# Altium project CanSat ADCS.PrjPcb
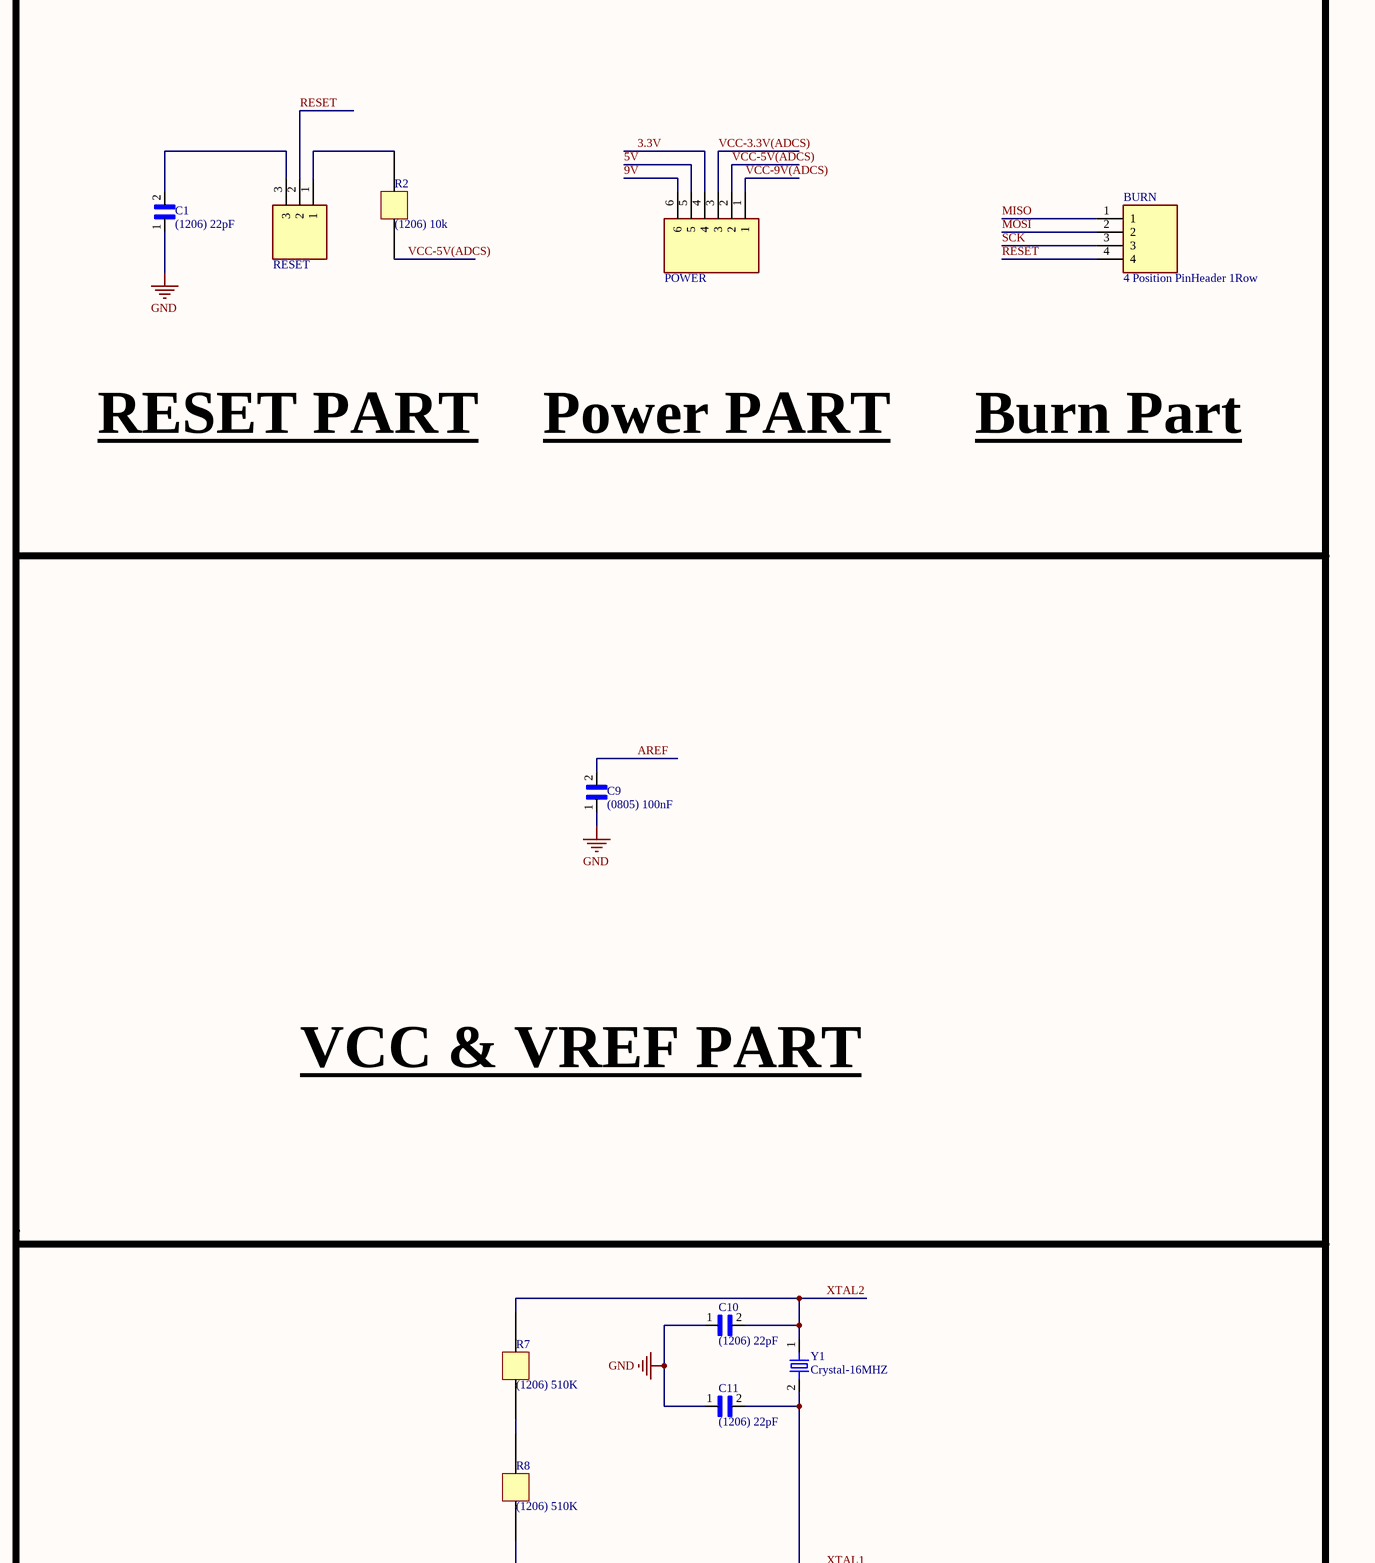
[diagram p0: CanSat ADCS.SchDoc, top left]
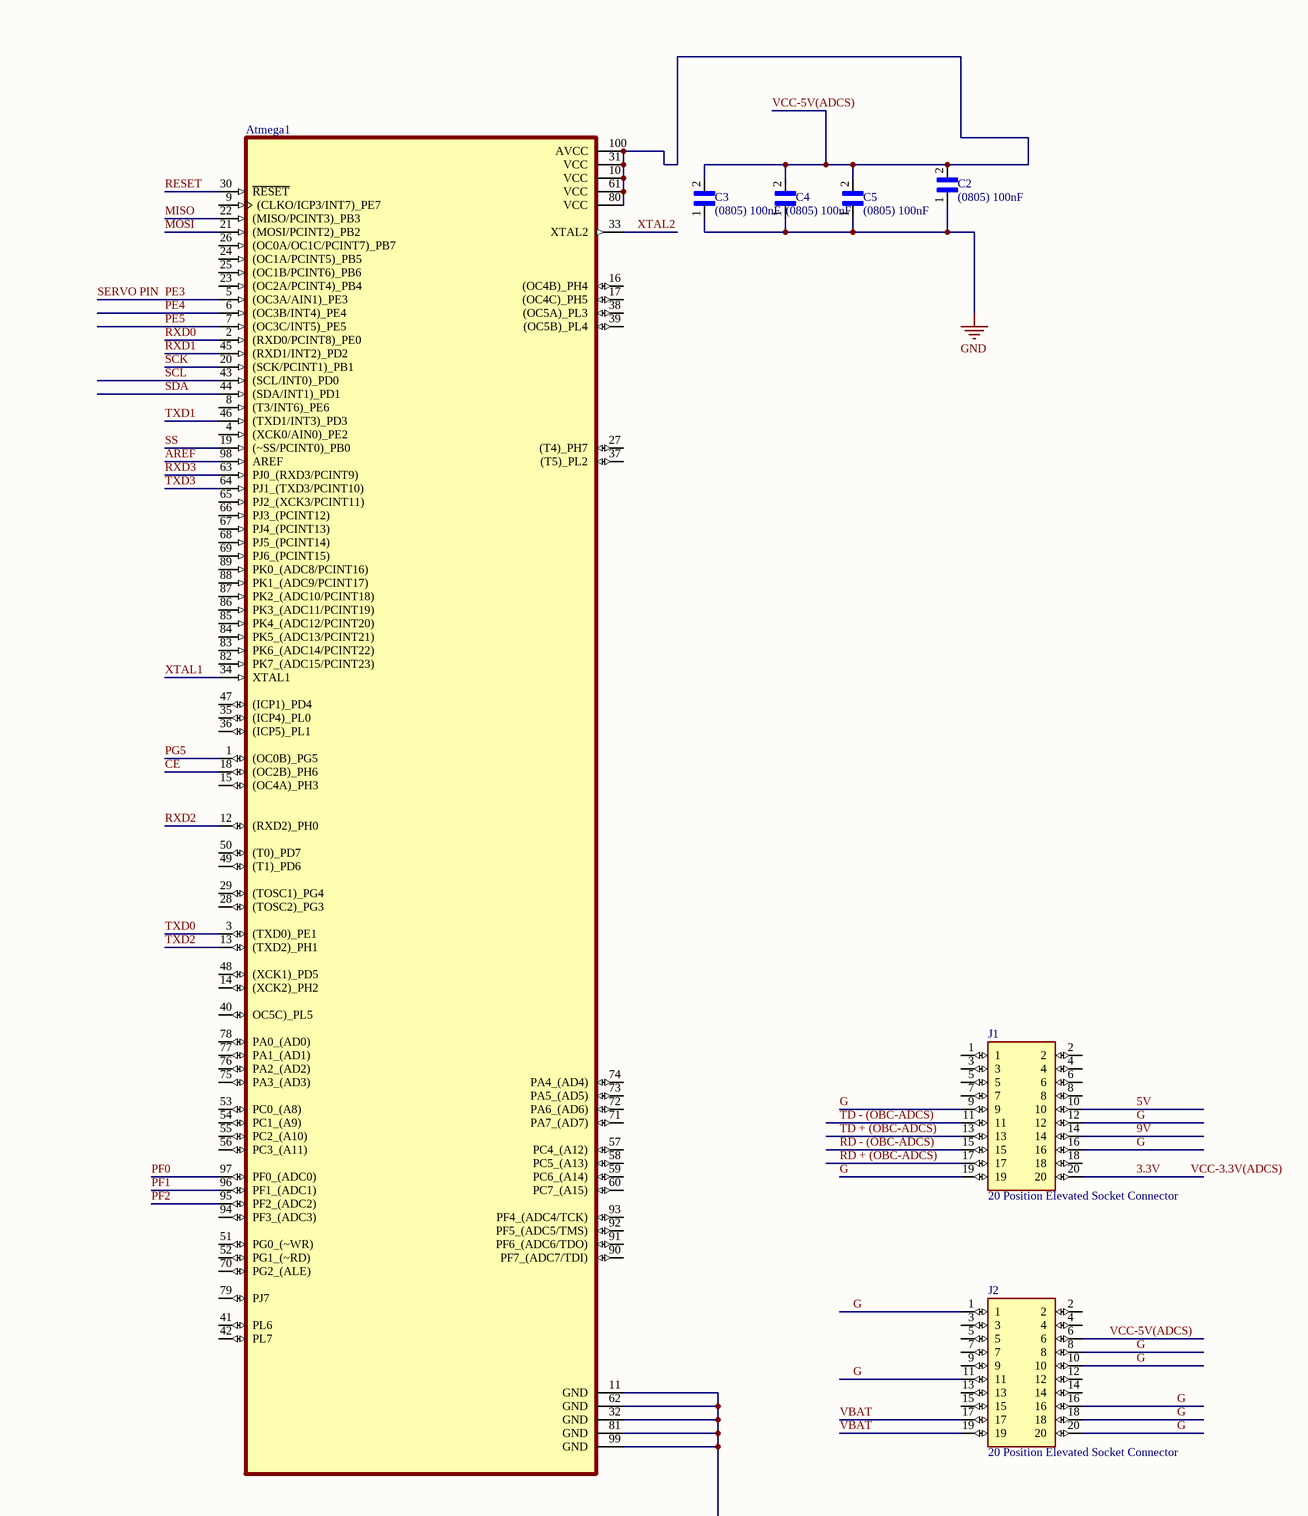
[diagram p1: CanSat ADCS.SchDoc, top middle]
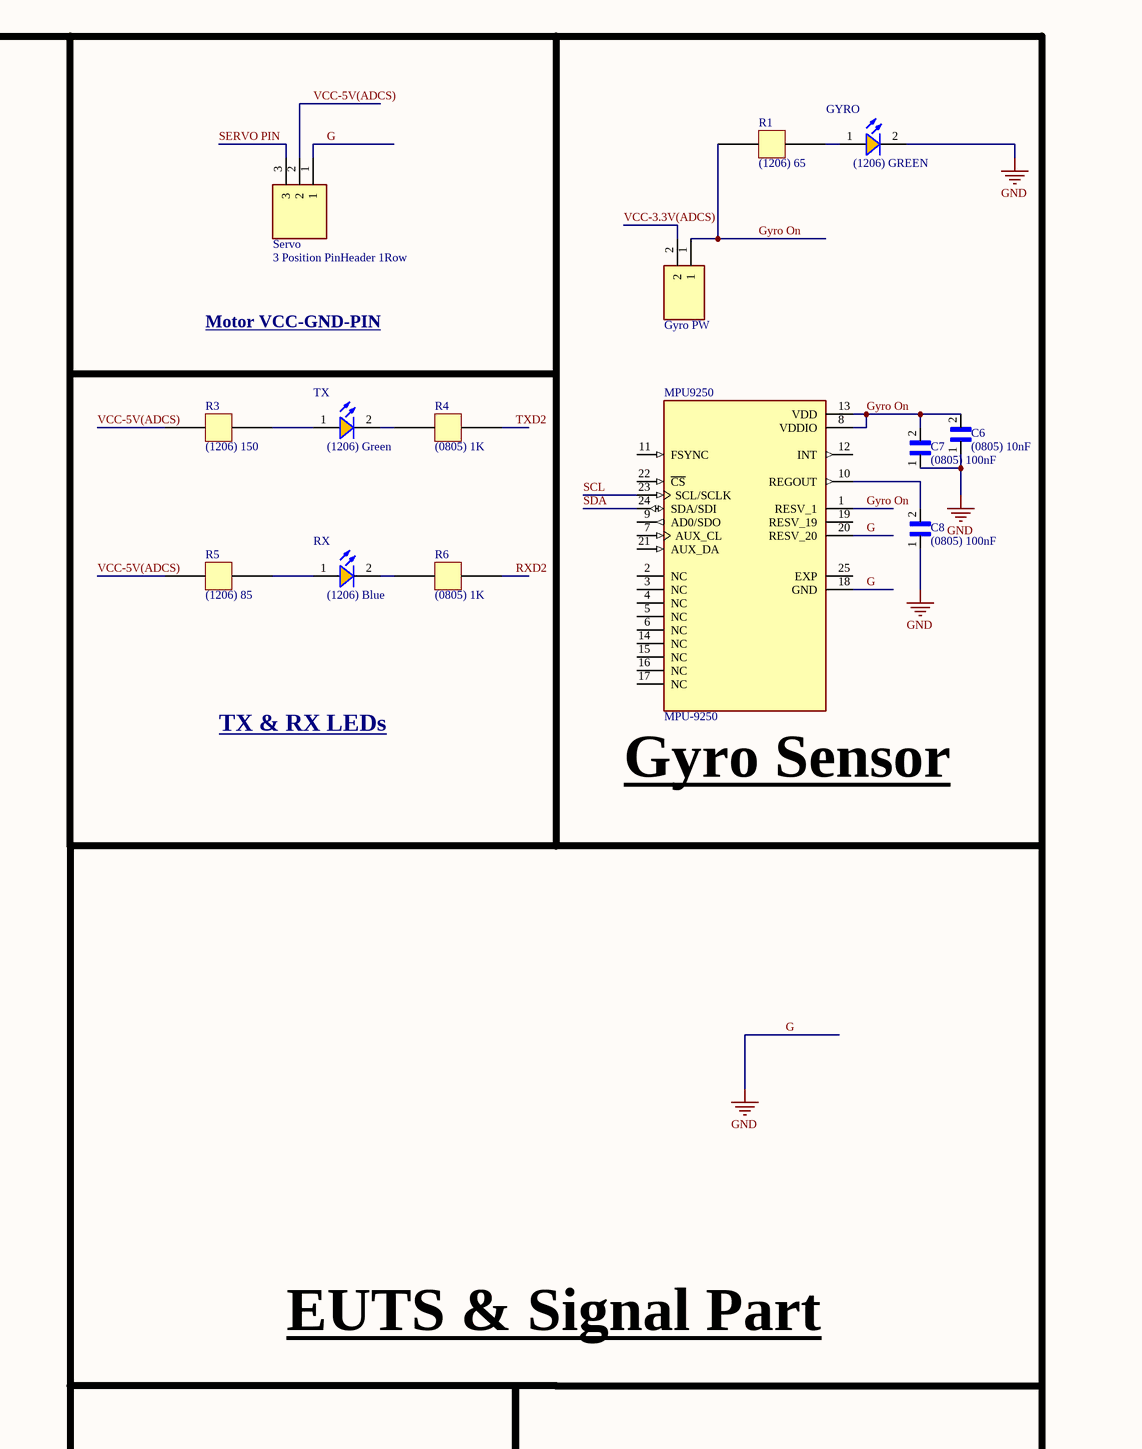
[diagram p2: CanSat ADCS.SchDoc, top right]
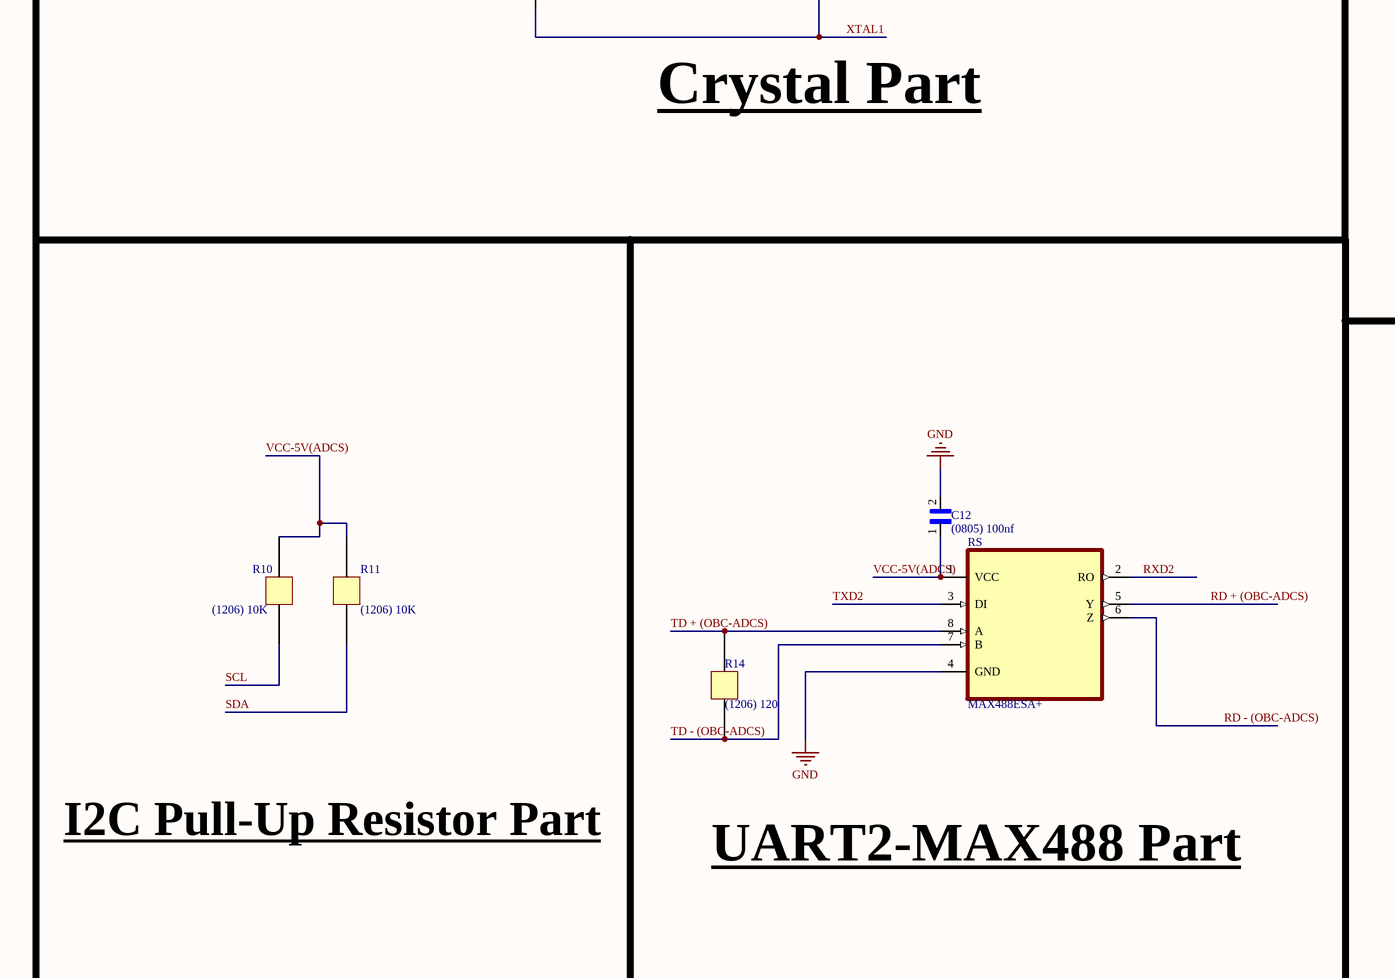
[diagram p3: CanSat ADCS.SchDoc, bottom left]
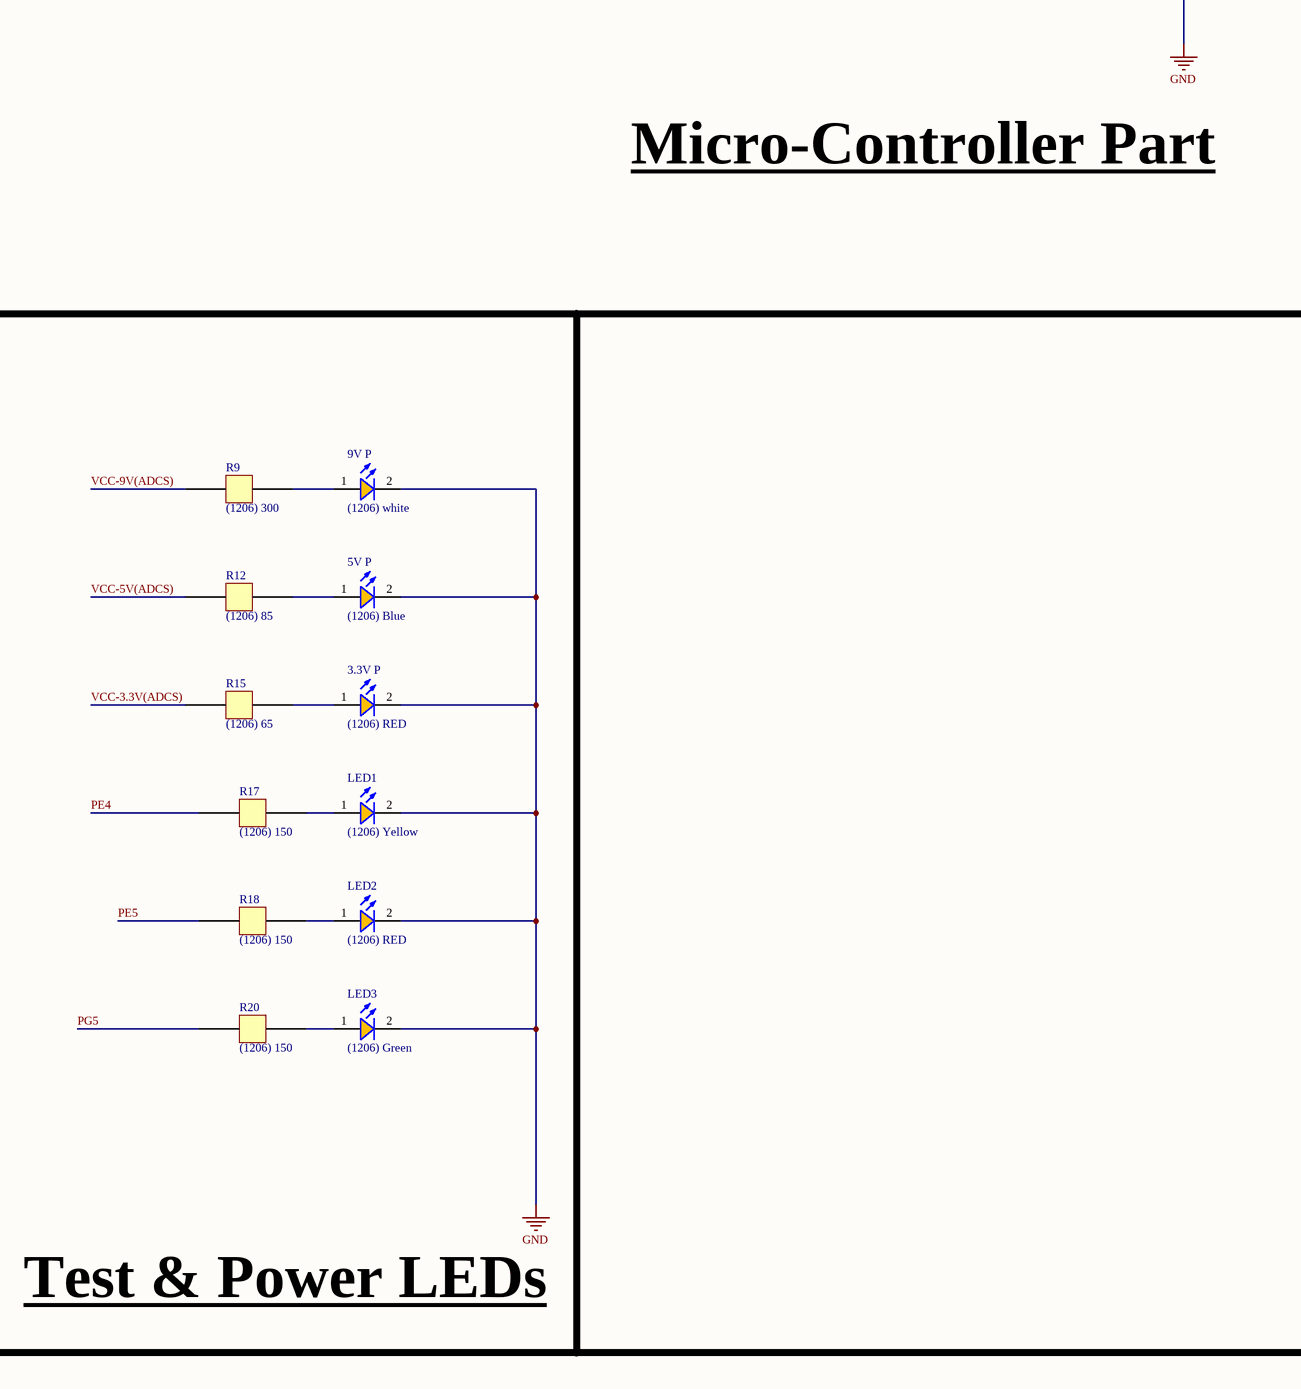
[diagram p4: CanSat ADCS.SchDoc, bottom middle]
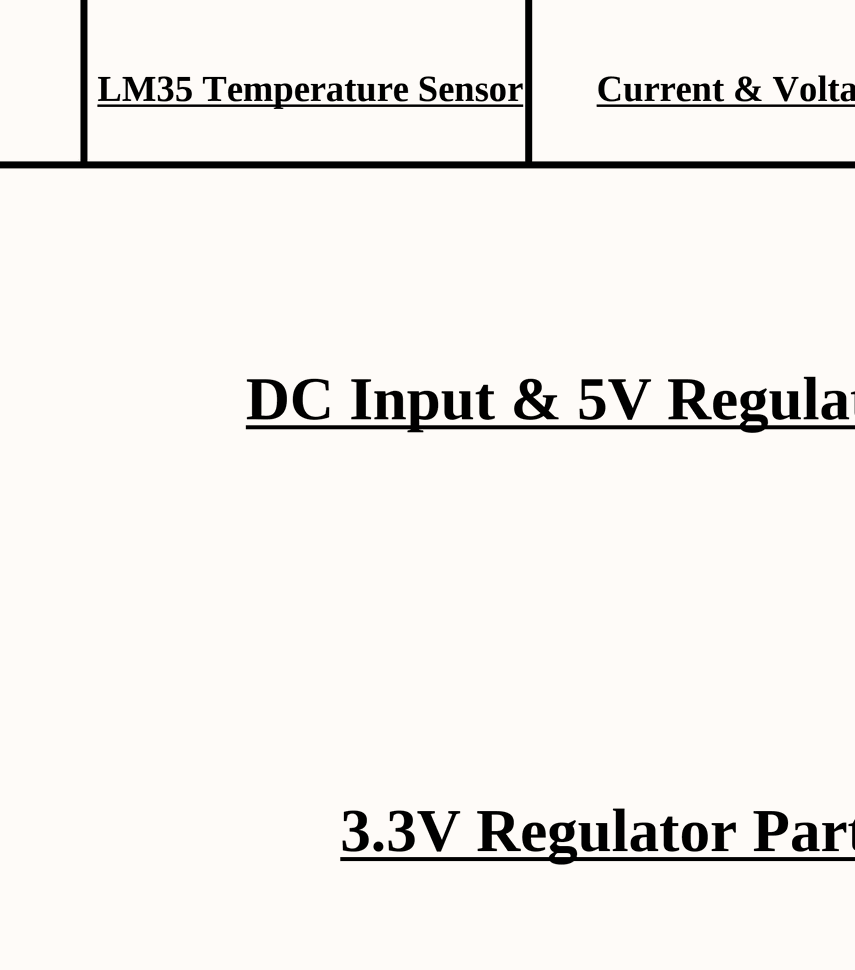
[diagram p5: CanSat ADCS.SchDoc, bottom right]
1 sheet, 49 parts. Net scope: global (net labels, ports and power ports of the same name join across sheets).
Board file: CanSat ADCS.PcbDoc

## Sheet CanSat ADCS.SchDoc
size A1; SheetNumber: 1; SheetTotal: 1

### Parts
3.3V_P  (1206) RED  [RESC3015X65-01]
5V_P  (1206) Blue  [RESC3015X65-01]
9V_P  (1206) white  [RESC3015X65-01]
Atmega1  (no value)  [QFP50P1600X1600X120-100N]
BURN  4 Position PinHeader 1Row  [TE_3-644456-4]
C1  (1206) 22pF  [CAPC3216X125N0]
C2  (0805) 100nF  [CAPC2012X95N-0]
C3  (0805) 100nF  [CAPC2012X95N-0]
C4  (0805) 100nF  [CAPC2012X95N-0]
C5  (0805) 100nF  [CAPC2012X95N-0]
C6  (0805) 10nF  [CAPC2012X95N-0]
C7  (0805) 100nF  [CAPC2012X95N-0]
C8  (0805) 100nF  [CAPC2012X95N-0]
C9  (0805) 100nF  [CAPC2012X95N-0]
C10  (1206) 22pF  [CAPC3216X125N0]
C11  (1206) 22pF  [CAPC3216X125N0]
C12  (0805) 100nf  [CAPC2012X95N-0]
GYRO  (1206) GREEN  [RESC3015X65-01]
Gyro_PW  2 Position PinHeader  [TE_2-103327-2]  (value not drawn)
J1  20 Position Elevated Socket Connector  [ESQ-110-XX-X-D]
J2  20 Position Elevated Socket Connector  [ESQ-110-XX-X-D]
LED1  (1206) Yellow  [RESC3015X65-01]
LED2  (1206) RED  [RESC3015X65-01]
LED3  (1206) Green  [RESC3015X65-01]
MPU9250  MPU-9250  [QFN40P300X300X105-25N]
POWER  6 Position PinHeader 1Row  [TE_6-146285-6]  (value not drawn)
R1  (1206) 65  [CAPC3216X125N0]
R2  (1206) 10k  [CAPC3216X125N0]
R3  (1206) 150  [CAPC3216X125N0]
R4  (0805) 1K  [CAPC2012X95N-0]
R5  (1206) 85  [CAPC3216X125N0]
R6  (0805) 1K  [CAPC2012X95N-0]
R7  (1206) 510K  [CAPC3216X125N0]
R8  (1206) 510K  [CAPC3216X125N0]
R9  (1206) 300  [CAPC3216X125N0]
R10  (1206) 10K  [CAPC3216X125N0]
R11  (1206) 10K  [CAPC3216X125N0]
R12  (1206) 85  [CAPC3216X125N0]
R14  (1206) 120  [CAPC3216X125N0]
R15  (1206) 65  [CAPC3216X125N0]
R17  (1206) 150  [CAPC3216X125N0]
R18  (1206) 150  [CAPC3216X125N0]
R20  (1206) 150  [CAPC3216X125N0]
RESET  3 Position PinHeader 1Row  [TE_3-103327-3]  (value not drawn)
RS  MAX488ESA+  [SOIC127P600X175-8N0]
RX  (1206) Blue  [RESC3015X65-01]
Servo  3 Position PinHeader 1Row  [TE_3-103327-3]
TX  (1206) Green  [RESC3015X65-01]
Y1  Crystal-16MHZ  [XTAL1140X490X430N-0]

### Nets
G: 3.3V_P.2(K) 5V_P.2(K) 9V_P.2(K) Atmega1.11(GND) Atmega1.32(GND) Atmega1.62(GND) Atmega1.81(GND) Atmega1.99(GND) C1.1 C2.1 C3.1 C4.1 C5.1 C6.1 C7.1 C8.1 C9.1 C10.1 C11.1 C12.2 GYRO.2(K) J1.9 J1.12 J1.16 J1.19 J2.1 J2.8 J2.10 J2.11 J2.16 J2.18 J2.20 LED1.2(K) LED2.2(K) LED3.2(K) MPU9250.18(GND) MPU9250.20(RESV_20) RS.4(GND) Servo.1  [also labelled GND]
3.3V: Gyro_PW.2 J1.20 POWER.3 POWER.4 R15.1  [also labelled VCC-3.3V(ADCS)]
5V: J1.10 POWER.5
9V: J1.14 POWER.6
AREF: Atmega1.98(AREF) C9.2
CE: Atmega1.18((OC2B)_PH6)
Gyro On: C6.2 C7.2 Gyro_PW.1 MPU9250.1(RESV_1) MPU9250.8(VDDIO) MPU9250.13(VDD) R1.1
MISO: Atmega1.22((MISO/PCINT3)_PB3) BURN.1
MOSI: Atmega1.21((MOSI/PCINT2)_PB2) BURN.2
PE3: Atmega1.5((OC3A/AIN1)_PE3) Servo.3  [also labelled SERVO PIN]
PE4: Atmega1.6((OC3B/INT4)_PE4) R17.1
PE5: Atmega1.7((OC3C/INT5)_PE5) R18.1
PF0: Atmega1.97(PF0_(ADC0))
PF1: Atmega1.96(PF1_(ADC1))
PF2: Atmega1.95(PF2_(ADC2))
PG5: Atmega1.1((OC0B)_PG5) R20.1
RD + (OBC-ADCS): J1.17 RS.5(Y)
RD - (OBC-ADCS): J1.15 RS.6(Z)
RESET: Atmega1.30(~{RESET}) BURN.4 RESET.2
RXD0: Atmega1.2((RXD0/PCINT8)_PE0)
RXD1: Atmega1.45((RXD1/INT2)_PD2)
RXD2: Atmega1.12((RXD2)_PH0) R6.2 RS.2(RO)
RXD3: Atmega1.63(PJ0_(RXD3/PCINT9))
SCK: Atmega1.20((SCK/PCINT1)_PB1) BURN.3
SCL: Atmega1.43((SCL/INT0)_PD0) MPU9250.23(SCL/SCLK) R10.2
SDA: Atmega1.44((SDA/INT1)_PD1) MPU9250.24(SDA/SDI) R11.2
SS: Atmega1.19((~SS/PCINT0)_PB0)
TD + (OBC-ADCS): J1.13 R14.2 RS.8(A)
TD - (OBC-ADCS): J1.11 R14.1 RS.7(B)
TXD0: Atmega1.3((TXD0)_PE1)
TXD1: Atmega1.46((TXD1/INT3)_PD3)
TXD2: Atmega1.13((TXD2)_PH1) R4.2 RS.3(DI)
TXD3: Atmega1.64(PJ1_(TXD3/PCINT10))
VBAT: J2.17 J2.19
VCC-5V(ADCS): Atmega1.10(VCC) Atmega1.31(VCC) Atmega1.61(VCC) Atmega1.80(VCC) Atmega1.100(AVCC) C2.2 C3.2 C4.2 C5.2 C12.1 J2.6 POWER.2 R2.1 R3.1 R5.1 R10.1 R11.1 R12.1 RS.1(VCC) Servo.2
VCC-9V(ADCS): POWER.1 R9.1
XTAL1: Atmega1.34(XTAL1) C11.2 R8.1 Y1.2
XTAL2: Atmega1.33(XTAL2) C10.2 R7.2 Y1.1
Net3.3V_P_1: 3.3V_P.1(A) R15.2
Net5V_P_1: 5V_P.1(A) R12.2
Net9V_P_1: 9V_P.1(A) R9.2
NetC1_2: C1.2 RESET.3
NetC8_2: C8.2 MPU9250.10(REGOUT)
NetGYRO_1: GYRO.1(A) R1.2
NetLED1_1: LED1.1(A) R17.2
NetLED2_1: LED2.1(A) R18.2
NetLED3_1: LED3.1(A) R20.2
NetR2_2: R2.2 RESET.1
NetR3_2: R3.2 TX.1(A)
NetR4_1: R4.1 TX.2(K)
NetR5_2: R5.2 RX.1(A)
NetR6_1: R6.1 RX.2(K)
NetR7_1: R7.1 R8.2

Not connected (* = marked no-connect by the designer): Atmega1 4((XCK0/AIN0)_PE2) 8((T3/INT6)_PE6) 9((CLKO/ICP3/INT7)_PE7) 14((XCK2)_PH2) 15((OC4A)_PH3) 16((OC4B)_PH4) 17((OC4C)_PH5) 23((OC2A/PCINT4)_PB4) 24((OC1A/PCINT5)_PB5) 25((OC1B/PCINT6)_PB6) 26((OC0A/OC1C/PCINT7)_PB7) 27((T4)_PH7) 28((TOSC2)_PG3) 29((TOSC1)_PG4) 35((ICP4)_PL0) 36((ICP5)_PL1) 37((T5)_PL2) 38((OC5A)_PL3) 39((OC5B)_PL4) 40(OC5C)_PL5) 41(PL6) 42(PL7) 47((ICP1)_PD4) 48((XCK1)_PD5) 49((T1)_PD6) 50((T0)_PD7) 51(PG0_(~WR)) 52(PG1_(~RD)) 53(PC0_(A8)) 54(PC1_(A9)) 55(PC2_(A10)) 56(PC3_(A11)) 57(PC4_(A12)) 58(PC5_(A13)) 59(PC6_(A14)) 60(PC7_(A15)) 65(PJ2_(XCK3/PCINT11)) 66(PJ3_(PCINT12)) 67(PJ4_(PCINT13)) 68(PJ5_(PCINT14)) 69(PJ6_(PCINT15)) 70(PG2_(ALE)) 71(PA7_(AD7)) 72(PA6_(AD6)) 73(PA5_(AD5)) 74(PA4_(AD4)) 75(PA3_(AD3)) 76(PA2_(AD2)) 77(PA1_(AD1)) 78(PA0_(AD0)) 79(PJ7) 82(PK7_(ADC15/PCINT23)) 83(PK6_(ADC14/PCINT22)) 84(PK5_(ADC13/PCINT21)) 85(PK4_(ADC12/PCINT20)) 86(PK3_(ADC11/PCINT19)) 87(PK2_(ADC10/PCINT18)) 88(PK1_(ADC9/PCINT17)) 89(PK0_(ADC8/PCINT16)) 90(PF7_(ADC7/TDI)) 91(PF6_(ADC6/TDO)) 92(PF5_(ADC5/TMS)) 93(PF4_(ADC4/TCK)) 94(PF3_(ADC3)); J1 1 2 3 4 5 6 7 8 18; J2 2 3 4 5 7 9 12 13 14 15; MPU9250 2(NC) 3(NC) 4(NC) 5(NC) 6(NC) 7(AUX_CL) 9(AD0/SDO) 11(FSYNC) 12(INT) 14(NC) 15(NC) 16(NC) 17(NC) 19(RESV_19) 21(AUX_DA) 22(~{CS}) 25(EXP)

### Notes on the sheet
- Motor VCC-GND-PIN
- RESET PART
- Power PART
- Burn Part
- TX & RX LEDs
- (near MPU9250) Gyro Sensor
- VCC & VREF PART
- EUTS & Signal Part
- Crystal Part
- Micro-Controller Part
- LM35 Temperature Sensor
- Current & Voltage Sensor
- DC Input & 5V Regulator Part
- I2C Pull-Up Resistor Part
- UART2-MAX488 Part
- 3.3V Regulator Part
- Test & Power LEDs

### Library data of the parts
3.3V_P 5V_P 9V_P GYRO LED1-LED3 RX TX = LED 1206: LED SMD 1206 High Quality Forward Voltage: 3.2 V / Brightness: 700 mcd; Manufacturer: Wurth Elektronik; Manufacturer Part Number: 150060AS75003; Chip Technology: AlInGaP; Dominant Wavelength: 605nm; Emitting Color: Amber; Forward Voltage: 2V; Luminous Intensity: 350mcd; Peak Wavelength: 610nm; Viewing Angle: 140°; ComponentLink1Description: Manufacturer Link; ComponentLink1URL: http://www.we-online.de; ComponentLink2Description: Datasheet; ComponentLink2URL: https://www.we-online.com/catalog/datasheet/150060AS75003.pdf; Height: 0.7mm; Length: 1.6mm; Mounting Technology: SMT; Operating Temperature max.: 100C; Operating Temperature min.: -40C; Packaging: Tape and Reel; Size: 0603; Width: 0.8mm
Atmega1 = ATMEGA2560-16AU: Value: *; MP: ATMEGA2560-16AU; Package: None; Availability: Unavailable; Price: None
BURN = 4 Position PinHeader 1Row: Conn Unshrouded Header HDR 4 POS 2.54mm Solder ST Thru-Hole Bag/Box; MP: 3-644456-4; Number_of_Positions: 4; Product_Type: Connector; MF: TE Connectivity; Centerline_Pitch: 2.54 mm[.1 in]; Package: None; Availability: Warning; EU_RoHS_Compliance: Compliant; SnapEDA_Link: https://www.snapeda.com/parts/3-644456-4/TE%20Connectivity%20AMP%20Connectors/view-part/482664/?ref=snap; DigiKey-Purchase-URL: https://snapeda.com/shop?store=DigiKey&id=482664; Mouser-Purchase-URL: https://snapeda.com/shop?store=Mouser&id=482664; Price: None; Value: *
C1 C10 C11 = Capacitor 1206: UMF316B7103KFHT/1206 Capacitor; Package: None; Price: None; Value: *; MP: UMF316B7103KFHT; Availability: Unavailable
C2-C9 C12 = Capacitor 0805: UMK212SD103KD-T/CAP CER 10000PF 50V 0805; Package: None; Price: None; Value: *; MP: UMK212SD103KD-T; Availability: Unavailable
Gyro_PW = 2 Position PinHeader: Cabezal del conector Agujero pasante 2 posiciones 0,100 (2,54 mm); MP: 4-103327-4; MF: TE Connectivity; SnapEDA_Link: https://www.snapeda.com/parts/4-103327-4/TE%20Connectivity%20AMP%20Connectors/view-part/2403998/?ref=snap; Purchase-URL: https://pricing.snapeda.com/search/part/4-103327-4/?ref=eda; Value: *; Package: None; EU_RoHS_Compliance: Compliant; Price: None; Availability: Warning; Check_prices: https://www.snapeda.com/parts/4-103327-4/TE%20Connectivity%20AMP%20Connectors/view-part/2403998/?ref=eda
J1 J2 = 20 Position Elevated Socket Connector: 20 Position Elevated Socket Connector Through Hole; MP: ESQ-110-14-T-D; MF: Samtec; Package: None; SnapEDA_Link: https://www.snapeda.com/parts/ESQ-110-14-T-D/Samtec%20Inc./view-part/786056/?ref=snap; Value: *; Availability: Unavailable; Price: None
MPU9250 = MPU-9250: MPU-9250 series Accelerometer, Gyroscope, Humidity, Magnetometer, Pressure, Temperature Sensor Evaluation Board; MF: TDK InvenSense; Package: TFQFN-24 TDK InvenSense; Purchase-URL: https://pricing.snapeda.com/search/part/MPU-9250/?ref=eda; Value: *; Price: None; Check_prices: https://www.snapeda.com/parts/MPU-9250/TDK+InvenSense/view-part/?ref=eda; MP: MPU-9250; SnapEDA_Link: https://www.snapeda.com/parts/MPU-9250/TDK+InvenSense/view-part/?ref=snap; Availability: In Stock
POWER = 6 Position PinHeader 1Row: Connector Header Through Hole 6 position 0.100 (2.54mm); MP: 5-146285-6; MF: TE Connectivity; DigiKey-Purchase-URL: https://snapeda.com/shop?store=DigiKey&id=2411669; EU_RoHS_Compliance: Compliant; Package: None; Value: *; SnapEDA_Link: https://www.snapeda.com/parts/5-146285-6/TE%20Connectivity%20AMP%20Connectors/view-part/2411669/?ref=snap; Digi-Key_Part_Number: A122872-ND
R1-R3 R5 R7-R12 R14 R15 R17 R18 R20 = Resistor 1206
R4 R6 = Resistor 0805
RESET Servo = 3 Position PinHeader 1Row: Conn Unshrouded Header HDR 3 POS 2.54mm Solder ST Thru-Hole Carton; MF: TE Connectivity; MP: 4-103327-5; Package: None; Value: *; TE_purchase_URL: https://www.te.com/usa-en/product-4-103327-5.html?te_bu=Cor&te_type=disp&te_campaign=seda_glo_cor-seda-global-disp-prtnr-fy19-seda-model-bom-cta_sma-317_1&elqCampaignId=32493; Price: None; SnapEDA_Link: https://www.snapeda.com/parts/4-103327-5/TE%20Connectivity%20AMP%20Connectors/view-part/2403997/?ref=snap; Availability: Unavailable; EU_RoHS_Compliance: Compliant
RS = MAX488ESA+: 1/1 Transceiver Full RS422, RS485 8-SOIC; MP: MAX488ESA+T; MF: Maxim Integrated; Price: None; Package: SOIC-8 Maxim; Availability: Unavailable; SnapEDA_Link: https://www.snapeda.com/parts/MAX488ESA+T/Maxim%20Integrated/view-part/48834/?ref=snap; Value: *